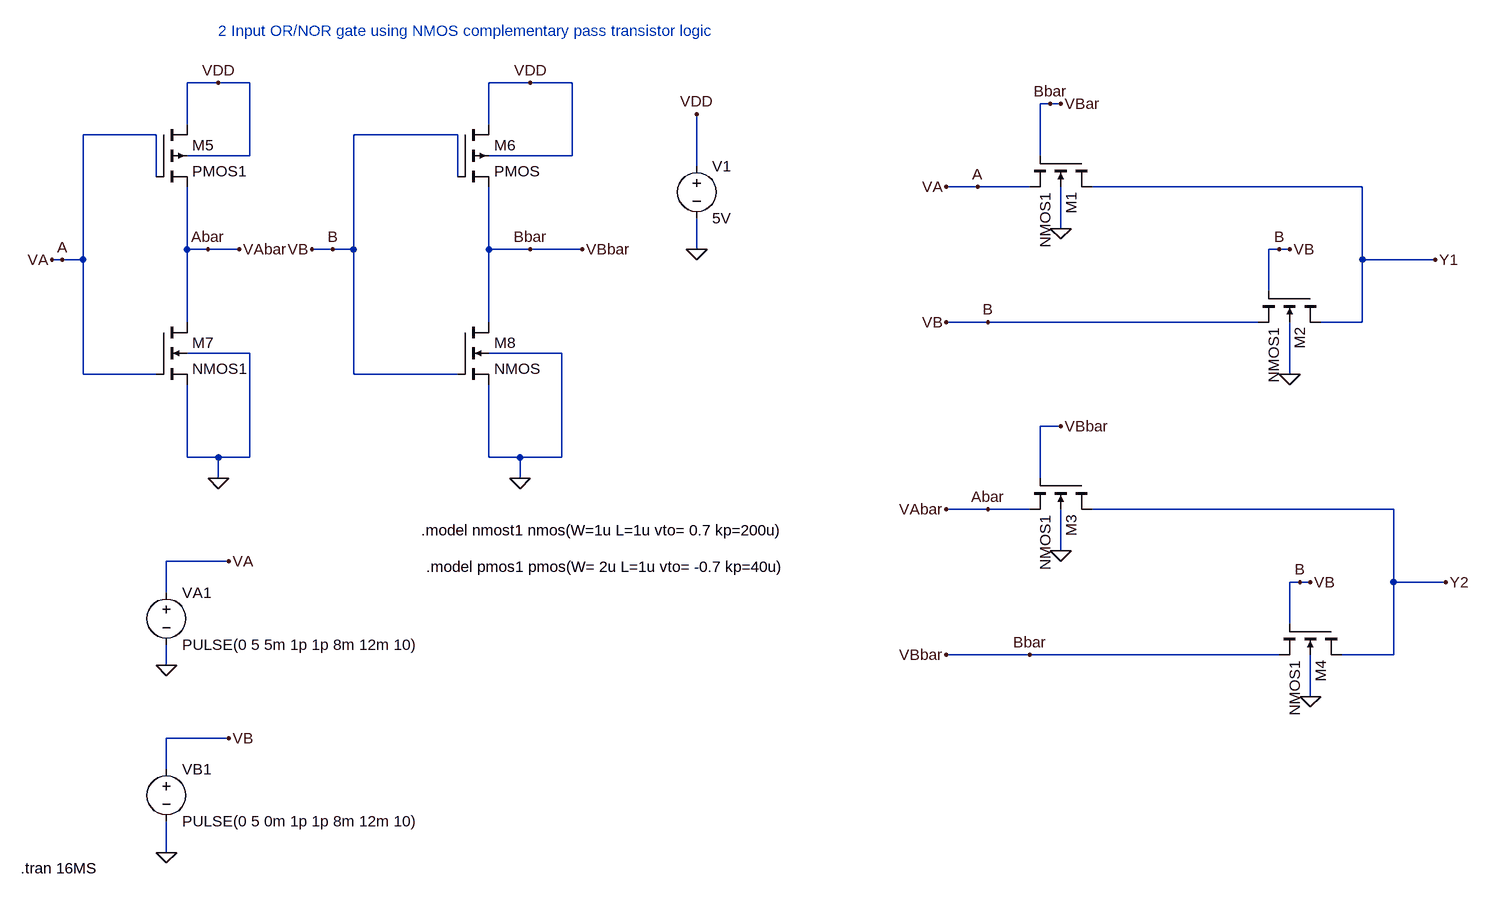
[diagram p0: schematic 2or.nor cpl.asc]
2or.nor cpl.asc, the LTspice schematic file:
Version 4
SHEET 1 1952 1112
WIRE 16 -112 -32 -112
WIRE 64 -112 16 -112
WIRE 496 -112 432 -112
WIRE 560 -112 496 -112
WIRE 1296 -80 1280 -80
WIRE 1312 -80 1296 -80
WIRE -32 -48 -32 -112
WIRE 432 -48 432 -112
WIRE -80 -32 -192 -32
WIRE 384 -32 224 -32
WIRE 64 0 64 -112
WIRE 64 0 -32 0
WIRE 560 0 560 -112
WIRE 560 0 432 0
WIRE 1280 0 1280 -80
WIRE 752 16 752 -64
WIRE -80 32 -80 -32
WIRE 384 32 384 -32
WIRE 1184 48 1136 48
WIRE 1264 48 1184 48
WIRE 1776 48 1360 48
WIRE 1312 112 1312 48
WIRE -32 144 -32 48
WIRE 0 144 -32 144
WIRE 48 144 0 144
WIRE 192 144 160 144
WIRE 224 144 224 -32
WIRE 224 144 192 144
WIRE 432 144 432 48
WIRE 496 144 432 144
WIRE 576 144 496 144
WIRE 752 144 752 96
WIRE 1648 144 1632 144
WIRE 1664 144 1648 144
WIRE -224 160 -240 160
WIRE -192 160 -192 -32
WIRE -192 160 -224 160
WIRE 1776 160 1776 48
WIRE 1888 160 1776 160
WIRE 1632 208 1632 144
WIRE -32 256 -32 144
WIRE 432 256 432 144
WIRE 1200 256 1136 256
WIRE 1616 256 1200 256
WIRE 1776 256 1776 160
WIRE 1776 256 1712 256
WIRE 64 304 -32 304
WIRE 544 304 432 304
WIRE -192 336 -192 160
WIRE -80 336 -192 336
WIRE 224 336 224 144
WIRE 384 336 224 336
WIRE 1664 336 1664 256
WIRE 1312 416 1280 416
WIRE -32 464 -32 352
WIRE 16 464 -32 464
WIRE 64 464 64 304
WIRE 64 464 16 464
WIRE 432 464 432 352
WIRE 480 464 432 464
WIRE 544 464 544 304
WIRE 544 464 480 464
WIRE 16 496 16 464
WIRE 480 496 480 464
WIRE 1280 496 1280 416
WIRE 1200 544 1136 544
WIRE 1264 544 1200 544
WIRE 1824 544 1360 544
WIRE 1312 608 1312 544
WIRE 32 624 -64 624
WIRE 1680 656 1664 656
WIRE 1696 656 1680 656
WIRE 1824 656 1824 544
WIRE 1904 656 1824 656
WIRE -64 672 -64 624
WIRE 1664 720 1664 656
WIRE 1264 768 1136 768
WIRE 1648 768 1264 768
WIRE 1824 768 1824 656
WIRE 1824 768 1744 768
WIRE -64 784 -64 752
WIRE 1696 832 1696 768
WIRE 32 896 -64 896
WIRE -64 944 -64 896
WIRE -64 1072 -64 1024
FLAG 480 496 0
FLAG 16 496 0
FLAG -240 160 VA
FLAG 0 144 Abar
FLAG 48 144 VAbar
FLAG 496 144 Bbar
FLAG 576 144 VBbar
FLAG 160 144 VB
FLAG 752 144 0
FLAG 752 -64 VDD
FLAG 1312 112 0
FLAG 1664 336 0
FLAG 1312 608 0
FLAG 1696 832 0
FLAG 1200 544 Abar
FLAG 1264 768 Bbar
FLAG 1136 768 VBbar
FLAG 1136 544 VAbar
FLAG 1648 144 B
FLAG 1664 144 VB
FLAG 1680 656 B
FLAG 1696 656 VB
FLAG 1904 656 Y2
FLAG 1888 160 Y1
FLAG 1312 416 VBbar
FLAG 1200 256 B
FLAG 1184 48 A
FLAG 1296 -80 Bbar
FLAG 1312 -80 VBar
FLAG 1136 48 VA
FLAG 1136 256 VB
FLAG -64 784 0
FLAG -64 1072 0
FLAG 32 624 VA
FLAG 32 896 VB
FLAG 16 -112 VDD
FLAG 496 -112 VDD
FLAG -224 160 A
FLAG 192 144 B
SYMBOL pmos4 -80 -48 R0
SYMATTR InstName M5
SYMATTR Value PMOS1
SYMBOL pmos4 384 -48 R0
SYMATTR InstName M6
SYMBOL nmos4 -80 256 R0
SYMATTR InstName M7
SYMATTR Value NMOS1
SYMBOL nmos4 384 256 R0
SYMATTR InstName M8
SYMBOL voltage 752 0 R0
SYMATTR InstName V1
SYMATTR Value 5V
SYMBOL nmos4 1360 0 R90
SYMATTR InstName M1
SYMATTR Value NMOS1
SYMBOL nmos4 1712 208 R90
SYMATTR InstName M2
SYMATTR Value NMOS1
SYMBOL nmos4 1360 496 R90
SYMATTR InstName M3
SYMATTR Value NMOS1
SYMBOL nmos4 1744 720 R90
SYMATTR InstName M4
SYMATTR Value NMOS1
SYMBOL voltage -64 656 R0
WINDOW 123 0 0 Left 0
WINDOW 39 0 0 Left 0
SYMATTR InstName VA1
SYMATTR Value PULSE(0 5 5m 1p 1p 8m 12m 10)
SYMBOL voltage -64 928 R0
WINDOW 123 0 0 Left 0
WINDOW 39 0 0 Left 0
SYMATTR InstName VB1
SYMATTR Value PULSE(0 5 0m 1p 1p 8m 12m 10)
TEXT 16 -192 Left 2 ;2 Input OR/NOR gate using NMOS complementary pass transistor logic
TEXT -288 1096 Left 2 !.tran 16MS
TEXT 328 576 Left 2 !.model nmost1 nmos(W=1u L=1u vto= 0.7 kp=200u)
TEXT 336 632 Left 2 !.model pmos1 pmos(W= 2u L=1u vto= -0.7 kp=40u)

The netlist it stands for:
* 2or.nor cpl.asc
M5 VDD A VAbar VDD PMOS1
M6 VDD B VBar VDD PMOS
M7 VAbar A 0 0 NMOS1
M8 VBar B 0 0 NMOS
V1 VDD 0 5V
M1 Y1 VBar A 0 NMOS1
M2 Y1 B B 0 NMOS1
M3 Y2 VBar VAbar 0 NMOS1
M4 Y2 B VBar 0 NMOS1
VA1 A 0 PULSE(0 5 5m 1p 1p 8m 12m 10)
VB1 B 0 PULSE(0 5 0m 1p 1p 8m 12m 10)
.model NMOS NMOS
.model PMOS PMOS
.lib standard.mos
* 2 Input OR/NOR gate using NMOS complementary pass transistor logic
.tran 16MS
.model nmost1 nmos(W=1u L=1u vto= 0.7 kp=200u)
.model pmos1 pmos(W= 2u L=1u vto= -0.7 kp=40u)
.backanno
.end